# Altium schematic sheet UI.SchDoc
size A; SheetNumber: 2; SheetTotal: 12
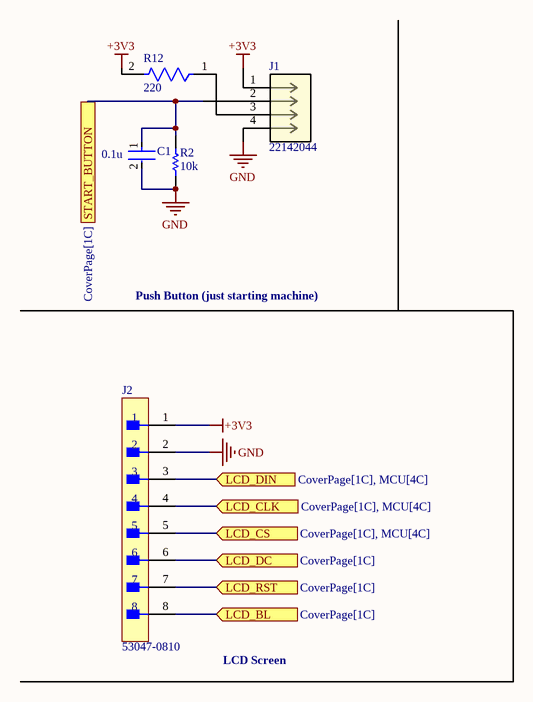
[diagram p0: UI.SchDoc]

## Parts
C1  0.1u  [FP-CL21-IPC_A]
J1  22142044  [CONN_SDA-4455_04_BE_MOL]
J2  53047-0810  [53047-0810_MFG]
R2  10k  [RESC2013X60X40LL20T25_A]
R12  220  [FP-CRCW0805-e3-MFG]

## Ports
LCD_BL (in, see CoverPage[1C]), LCD_CLK (in, see CoverPage[1C], MCU[4C]), LCD_CS (in, see CoverPage[1C], MCU[4C]), LCD_DC (in, see CoverPage[1C]), LCD_DIN (in, see CoverPage[1C], MCU[4C]), LCD_RST (in, see CoverPage[1C]), START_BUTTON (see CoverPage[1C])

## Nets
+3V3: J1.1 J2.1 R12.2
GND: C1.2 J1.4 J2.2 R2.1
LCD_BL: J2.8 ; port LCD_BL
LCD_CLK: J2.4 ; port LCD_CLK
LCD_CS: J2.5 ; port LCD_CS
LCD_DC: J2.6 ; port LCD_DC
LCD_DIN: J2.3 ; port LCD_DIN
LCD_RST: J2.7 ; port LCD_RST
START_BUTTON: C1.1 J1.2 R2.2 ; port START_BUTTON
NetJ1_3: J1.3 R12.1

## Notes on the sheet
- Push Button (just starting machine)
- LCD Screen

## Library data of the parts
C1 = CMP-13271-000411-1: CL21 Series 0805 100nF 100V ±10% Tolerance X7R Multilayer Ceramic Chip Capacitor
J1 = CMP-129-000000-1: No Description Available; Mfr_Name: Molex Connector Corporation; Design Item ID: 22142044; Type: Type; RefDes: RefDes; Source: 22142044.SchLib
J2 = CMP-00257-00276778-1: Conn Shrouded Header (4 Sides) HDR 8 POS 1.25mm Solder ST Top Entry Thru-Hole PicoBlade Tray; Manufacturer Lifecycle Status: ACTIVE; Gender: Male; Glow Wire Compliant: Non-compliant; Current Rating: 1A; Number of Positions: 8; Contact Resistance: 20mΩ; Insulation Resistance: 100MΩ; Plating: Tin; Voltage Rating (DC): 125V; Number of Circuits: 7; Schedule B: 8536694040, 8536694040; Max Operating Temperature: 85°C; Housing Material: Polyamide; Pitch: 1.25mm; Number of Rows: 1; ComponentLink1URL: http://molex.com; Country of Origin: MX; Case/Package: 0810; Height: 4.4mm; Housing Color: Natural; Flammability Rating: UL94 V-0; Orientation: Vertical; ComponentLink3Description: Manufacturer's Package Drawing; Mount: Through Hole; Min Operating Temperature: -40°C; Number of Pins: 8; Radiation Hardening: No; Contact Plating: Tin; Lead Pitch: 1.25mm; China RoHS: Compliant; ComponentLink1Description: Manufacturer's Website; Lead Free: Lead Free; ComponentLink2Description: Datasheet URL; RoHS: Compliant; Voltage Rating (AC): 125V; ComponentLink3URL: https://www.molex.com/content/dam/molex/molex-dot-com/products/automated/en-us/salesdrawingpdf/530/53047/530470810_sd.pdf?inline; Color: Natural; Number of Contacts: 8; Lifecycle Status: Production; HelpURL: https://www.molex.com/en-us/products/part-detail/530470810#part-details; ComponentLink2URL: https://www.molex.com/en-us/products/part-detail/530470810#part-details; REACH SVHC: Unknown; Contact Material: Tin; Termination: Through Hole; Voltage Rating: 125V
R2 = CMP-2001-00582-2: Metal Film Chip Resistor, High Reliability Type, 0.125 W, +/- 0.1%, -55 to 155 degC, 0805 (2012 Metric), RoHS, Tape and Reel; Voltage Rating: 100V; Power Rating: 125mW(1/8W); Brand: Panasonic; Temperature Coefficient: 25PPM/C; Resistance: 10kOhms; Product Category: ThinFilmResistors-SMD; Datasheet Version: 02/2016; Operating Temperature Range: -55Cto+155C; Length: 2mm; Mounting Technology: SurfaceMount; Manufacturer URL: http://www.panasonic.com/; Width: 1.25mm; Packaging: Reel; Product: ThinFilmResistorsSMD; Package / Case: 0805(2012metric); Termination Style: SMD/SMT; Tolerance: 0.1%; Datasheet URL: https://industrial.panasonic.com/cdbs/www-data/pdf/RDM0000/AOA0000C307.pdf; Package Description: 2-Pin Surface Mount Device, Body 2 x 1.25 mm; Factory Pack Quantity: 5000; Series: ERA-6A; Case Code - mm: 2012; RoHS: Details; Package Reference: 0805; Height: 0.5mm; Manufacturer: Panasonic; Case Code - in: 0805; Type: MetalFilmChipResistors
R12 = CMP-2001-03823-2: RES Thick Film, 330Ω, 1%, 0.125W, 100ppm/°C, 0805; Voltage Rating (DC): 150V; Resistance: 330R; Max Power Dissipation: 125mW; Mount: Surface Mount; Packaging: Tape and Reel; Min Operating Temperature: -55°C; Military Standard: Not; Case Code (Metric): 2012; Height: 0.02inch; Voltage Rating: 150V; Case/Package: 0805; Max Operating Temperature: 155°C; Width: 0.049inch; Case Code (Imperial): 0805; Termination: SMD/SMT; Lead Free: Lead Free; Contact Plating: Tin; Package Quantity: 10; Composition: Thick Film; Length: 2mm; Features: Automotive AEC-Q200; Depth: 1.25mm; Weight: 0.000194oz; Tolerance: 1%; Power Rating: 125mW; Number of Terminations: 2; Temperature Coefficient: 100ppm/°C